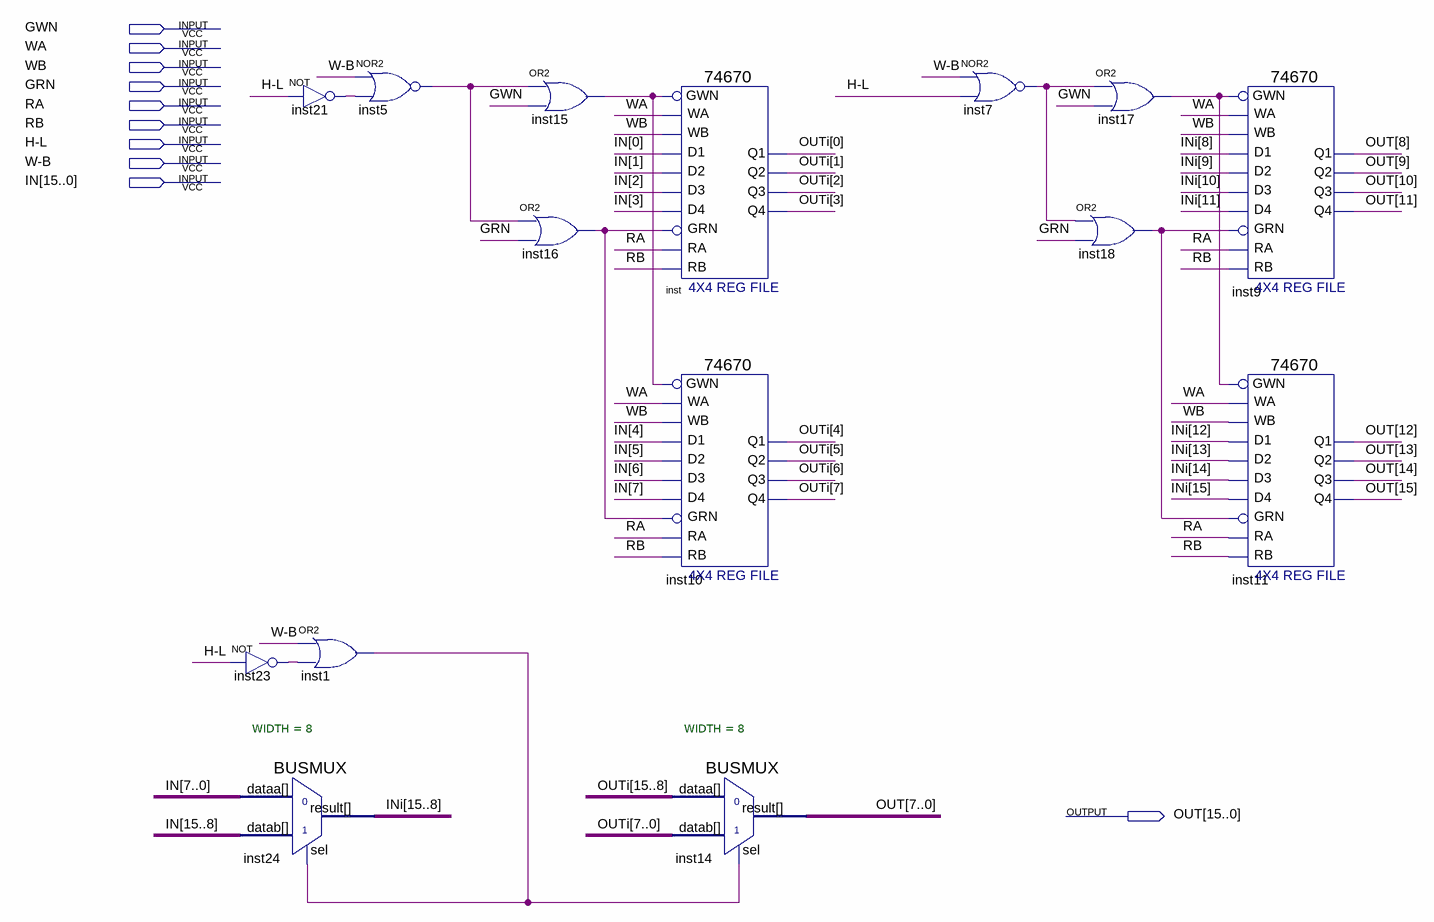
[diagram p0: schematic sheet]
// Quartus schematic RegisterGroup_16bitX4_eq8bitX8.bdf as structural Verilog: 15 symbols, 10 pins
module RegisterGroup_16bitX4_eq8bitX8 (
  input  GWN,
  input  WA,
  input  WB,
  input  GRN,
  input  RA,
  input  RB,
  input  \H-L ,
  input  \W-B ,
  input  [15:0] IN,
  output [15:0] OUT
);

  wire inst1_out, inst5_out, inst7_out, inst15_out, inst16_out, inst17_out, inst18_out, inst21_out,
       inst23_out;
  wire [15:0] OUTi;
  wire [15:8] INi;

  not inst23 (inst23_out, \H-L );
  BUSMUX #(.WIDTH(8)) inst24 (.datab(IN[15:8]), .sel(inst1_out), .dataa(IN[7:0]), .result(INi));
  not inst21 (inst21_out, \H-L );
  or inst1 (inst1_out, \W-B , inst23_out);
  nor inst5 (inst5_out, \W-B , inst21_out);
  or inst15 (inst15_out, inst5_out, GWN);
  or inst16 (inst16_out, inst5_out, GRN);
  \74670  inst (
    .WA(WA), .D1(IN[0]), .WB(WB), .D2(IN[1]), .GRN(inst16_out), .D4(IN[3]), .D3(IN[2]), .RA(RA), .RB(RB),
    .GWN(inst15_out), .Q3(OUTi[2]), .Q4(OUTi[3]), .Q1(OUTi[0]), .Q2(OUTi[1]));
  \74670  inst10 (
    .WA(WA), .D1(IN[4]), .WB(WB), .D2(IN[5]), .GRN(inst16_out), .D4(IN[7]), .D3(IN[6]), .RA(RA), .RB(RB),
    .GWN(inst15_out), .Q3(OUTi[6]), .Q4(OUTi[7]), .Q1(OUTi[4]), .Q2(OUTi[5]));
  BUSMUX #(.WIDTH(8)) inst14 (.datab(OUTi[7:0]), .sel(inst1_out), .dataa(OUTi[15:8]), .result(OUT[7:0]));
  nor inst7 (inst7_out, \W-B , \H-L );
  or inst18 (inst18_out, inst7_out, GRN);
  or inst17 (inst17_out, inst7_out, GWN);
  \74670  inst9 (
    .WA(WA), .D1(INi[8]), .WB(WB), .D2(INi[9]), .GRN(inst18_out), .D4(INi[11]), .D3(INi[10]), .RA(RA),
    .RB(RB), .GWN(inst17_out), .Q3(OUT[10]), .Q4(OUT[11]), .Q1(OUT[8]), .Q2(OUT[9]));
  \74670  inst11 (
    .WA(WA), .D1(INi[12]), .WB(WB), .D2(INi[13]), .GRN(inst18_out), .D4(INi[15]), .D3(INi[14]), .RA(RA),
    .RB(RB), .GWN(inst17_out), .Q3(OUT[14]), .Q4(OUT[15]), .Q1(OUT[12]), .Q2(OUT[13]));
endmodule
